# Altium schematic sheet 3phasedriver.SchDoc
size A4
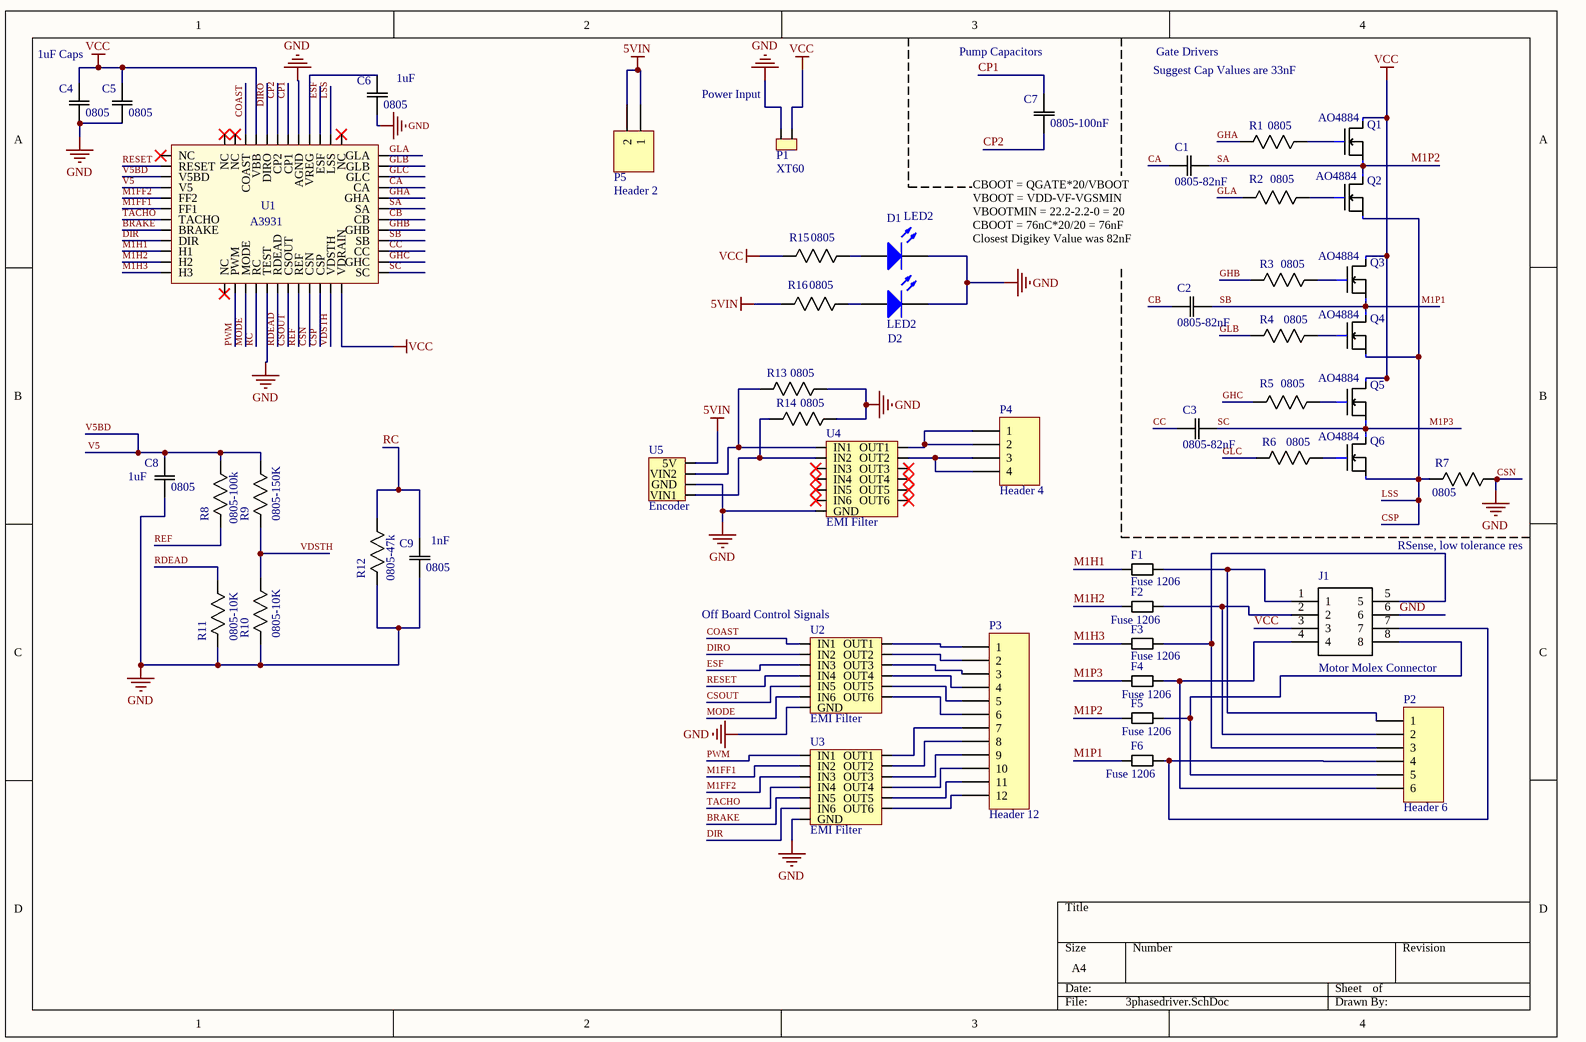
[diagram p0: 3phasedriver.SchDoc]

## Parts
C1  0805-82nF  [CAPC2013X110N]
C2  0805-82nF  [CAPC2013X110N]
C3  0805-82nF  [CAPC2013X110N]
C4  0805  [CAPC2013X110N]
C5  0805  [CAPC2013X110N]
C6  0805  [CAPC2013X110N]
C7  0805-100nF  [CAPC2013X110N]
C8  0805  [CAPC2013X110N]
C9  0805  [CAPC2013X110N]
D1  LED2  [3.2X1.6X1.1]
D2  LED2  [3.2X1.6X1.1]
F1  Fuse 1206  [PCBComponent_1]
F2  Fuse 1206  [PCBComponent_1]
F3  Fuse 1206  [PCBComponent_1]
F4  Fuse 1206  [PCBComponent_1]
F5  Fuse 1206  [PCBComponent_1]
F6  Fuse 1206  [PCBComponent_1]
J1  Motor Molex Connector  [*MOLEX_0039281083]
P1  XT60  [PCBComponent_1]
P2  Header 6  [HDR1X6]
P3  Header 12  [HDR1X12]
P4  Header 4  [HDR1X4]
P5  Header 2  [HDR1X2]
Q1  AO4884  [SOIC127P600X170-8N]
Q2  AO4884  [SOIC127P600X170-8N]
Q3  AO4884  [SOIC127P600X170-8N]
Q4  AO4884  [SOIC127P600X170-8N]
Q5  AO4884  [SOIC127P600X170-8N]
Q6  AO4884  [SOIC127P600X170-8N]
R1  0805  [RESC2013X65N]
R2  0805  [RESC2013X65N]
R3  0805  [RESC2013X65N]
R4  0805  [RESC2013X65N]
R5  0805  [RESC2013X65N]
R6  0805  [RESC2013X65N]
R7  0805  [RESC2013X65N]
R8  0805-100k  [RESC2013X65N]
R9  0805-150K  [RESC2013X65N]
R10  0805-10K  [RESC2013X65N]
R11  0805-10K  [RESC2013X65N]
R12  0805-47k  [RESC2013X65N]
R13  0805  [RESC2013X65N]
R14  0805  [RESC2013X65N]
R15  0805  [RESC2013X65N]
R16  0805  [RESC2013X65N]
U1  A3931  [CQFP50P900X900X160-48N]
U2  EMI Filter  [Filter]
U3  EMI Filter  [Filter]
U4  EMI Filter  [Filter]
U5  Encoder  [PCBComponent_1]

## Nets
5VIN: P5.1 P5.2 R16.2(R2) U5.5V
CSN: C4.1(C1) C5.1(C1) C6.1(C1) C8.1(C1) C9.1(C1) D1.2(K) D2.2(K) J1.6 P1.2 R7.1(R1) R10.2(R2) R11.2(R2) R12.2(R2) R13.1(R1) R14.1(R1) U1.17(TEST) U1.21(CSN) U1.41(AGND) U2.GND U3.GND U4.GND U5.GND  [also labelled GND]
VCC: C4.2(C2) C5.2(C2) J1.3 P1.1 Q1.D Q3.D Q5.D R15.2(R2) U1.24(VDRAIN) U1.45(VBB)
BRAKE: U1.8(BRAKE) U3.5(IN5)
CA: C1.1(C1) U1.33(CA)
CB: C2.1(C1) U1.30(CB)
CC: C3.1(C1) U1.27(CC)
COAST: U1.46(COAST) U2.1(IN1)
CP1: C7.2(C2) U1.42(CP1)
CP2: C7.1(C1) U1.43(CP2)
CSOUT: U1.19(CSOUT) U2.5(IN5)
CSP: Q2.S Q4.S Q6.S R7.2(R2) U1.22(CSP) U1.38(LSS)  [also labelled LSS]
DIR: U1.9(DIR) U3.6(IN6)
DIRO: U1.44(DIRO) U2.2(IN2)
ESF: U1.39(ESF) U2.3(IN3)
GHA: R1.2(R2) U1.32(GHA)
GHB: R3.2(R2) U1.29(GHB)
GHC: R5.2(R2) U1.26(GHC)
GLA: R2.2(R2) U1.36(GLA)
GLB: R4.2(R2) U1.35(GLB)
GLC: R6.2(R2) U1.34(GLC)
M1FF1: U1.6(FF1) U3.2(IN2)
M1FF2: U1.5(FF2) U3.3(IN3)
M1H1: F1.1 U1.10(H1)
M1H2: F2.1 U1.11(H2)
M1H3: F3.1 U1.12(H3)
M1P1: C2.2(C2) F6.1 Q3.S Q4.D U1.28(SB)  [also labelled SB]
M1P2: C1.2(C2) F5.1 Q1.S Q2.D U1.31(SA)  [also labelled SA]
M1P3: C3.2(C2) F4.1 Q5.S Q6.D U1.25(SC)  [also labelled SC]
MODE: U1.15(MODE) U2.6(IN6)
PWM: U1.14(PWM) U3.1(IN1)
RC: C9.2(C2) R12.1(R1) U1.16(RC)
RDEAD: R11.1(R1) U1.18(RDEAD)
REF: R8.2(R2) U1.20(REF)
RESET: U1.2(RESET) U2.4(IN4)
TACHO: U1.7(TACHO) U3.4(IN4)
V5: C8.2(C2) R8.1(R1) R9.1(R1) U1.3(V5BD) U1.4(V5)  [also labelled V5BD]
VDSTH: R9.2(R2) R10.1(R1) U1.23(VDSTH)
NetC6_2: C6.2(C2) U1.40(VREG)
NetD1_1: D1.1(A) R15.1(R1)
NetD2_1: D2.1(A) R16.1(R1)
NetF1_2: F1.2 J1.1 P2.1
NetF2_2: F2.2 J1.2 P2.2
NetF3_2: F3.2 J1.5 P2.3
NetF4_2: F4.2 J1.4 P2.6
NetF5_2: F5.2 J1.8 P2.5
NetF6_2: F6.2 J1.7 P2.4
NetP3_1: P3.1 U2.7(OUT1)
NetP3_2: P3.2 U2.8(OUT2)
NetP3_3: P3.3 U2.9(OUT3)
NetP3_4: P3.4 U2.10(OUT4)
NetP3_5: P3.5 U2.11(OUT5)
NetP3_6: P3.6 U2.12(OUT6)
NetP3_7: P3.7 U3.7(OUT1)
NetP3_8: P3.8 U3.8(OUT2)
NetP3_9: P3.9 U3.9(OUT3)
NetP3_10: P3.10 U3.10(OUT4)
NetP3_11: P3.11 U3.11(OUT5)
NetP3_12: P3.12 U3.12(OUT6)
NetP4_1: P4.1 P4.2 U4.7(OUT1)
NetP4_3: P4.3 P4.4 U4.8(OUT2)
NetQ1_G: Q1.G R1.1(R1)
NetQ2_G: Q2.G R2.1(R1)
NetQ3_G: Q3.G R3.1(R1)
NetQ4_G: Q4.G R4.1(R1)
NetQ5_G: Q5.G R5.1(R1)
NetQ6_G: Q6.G R6.1(R1)
NetR13_2: R13.2(R2) U4.1(IN1) U5.VIN2
NetR14_2: R14.2(R2) U4.2(IN2) U5.VIN1

Not connected (* = marked no-connect by the designer): U1 1(NC)* 13(NC)* 37(NC)* 47(NC)* 48(NC)*; U4 3(IN3)* 4(IN4)* 5(IN5)* 6(IN6)* 9(OUT3)* 10(OUT4)* 11(OUT5)* 12(OUT6)*

## Notes on the sheet
- 1uF Caps
- (near C6) 1uF
- (near P1) Power Input
- (near C7) Pump Capacitors
- Suggest Cap Values are 33nF
- Gate Drivers
- (near C1) CBOOT = QGATE*20/VBOOT
  VBOOT = VDD-VF-VGSMIN
  VBOOTMIN = 22.2-2.2-0 = 20
  CBOOT = 76nC*20/20 = 76nF
  Closest Digikey Value was 82nF
- (near C8) 1uF
- (near C9) 1nF
- RSense, low tolerance res
- (near U2) Off Board Control Signals

## Library data of the parts
C1-C9 = C0805C104K5RACTU: Capacitor; Ceramic; Cap; .100UF ; Tol+-10%; SMD; Vol-Rtg 50V; X7R, Tape/Reel; MF: Kemet; Package: 0805 Kemet; Availability: Good; MP: C0805C104K5RACTU; Price: 0.86 USD; Value: *
D1 D2 = LED2: Typical RED, GREEN, YELLOW, AMBER GaAs LED; Published: 8-Jun-2000; LatestRevisionDate: 17-Jul-2002; LatestRevisionNote: Re-released for DXP Platform.; PackageVersion: Feb-2002; PackageReference: 3.2X1.6X1.1; Publisher: Altium Limited; PackageDescription: SM LED; 2 Flat Leads
F1-F6 = F?
J1 = 0039281083: Conn Power HDR 8 POS 4.2mm Solder ST Thru-Hole 8 Terminal 1 Port Mini-Fit Jr??? Bag; MF: Molex; SnapEDA_Link: https://www.snapeda.com/parts/0039281083/Molex/view-part/?ref=snap; Availability: Unavailable; Package: None; Price: None; MP: 0039281083; Value: *
P1 Q1-Q6 U1 U5 = Component_1
P2 = Header 6: Header, 6-Pin; LatestRevisionDate: 17-Jul-2002; LatestRevisionNote: Re-released for DXP Platform.; Publisher: Altium Limited
P3 = Header 12: Header, 12-Pin; LatestRevisionDate: 17-Jul-2002; LatestRevisionNote: Re-released for DXP Platform.; Publisher: Altium Limited
P4 = Header 4: Header, 4-Pin; LatestRevisionDate: 17-Jul-2002; LatestRevisionNote: Re-released for DXP Platform.; Publisher: Altium Limited
P5 = Header 2: Header, 2-Pin; LatestRevisionDate: 17-Jul-2002; LatestRevisionNote: Re-released for DXP Platform.; Publisher: Altium Limited
R1-R16 = RC0805FR-072K2L: Res Thick Film 0805 2.2K Ohm 1% 0.125W_1/8W_ Â}100ppm/ÂÂŽ Molded SMD Paper T/R; MF: Yageo; Availability: Good; Price: 0.01 USD; Package: 0805 Yageo; MP: RC0805FR-072K2L; SnapEDA_Link: https://www.snapeda.com/parts/RC0805FR-072K2L/Yageo/view-part/?ref=snap; Value: *
U2-U4 = EMIFilter